# Altium schematic sheet MCU.SchDoc (part 3 of 3)
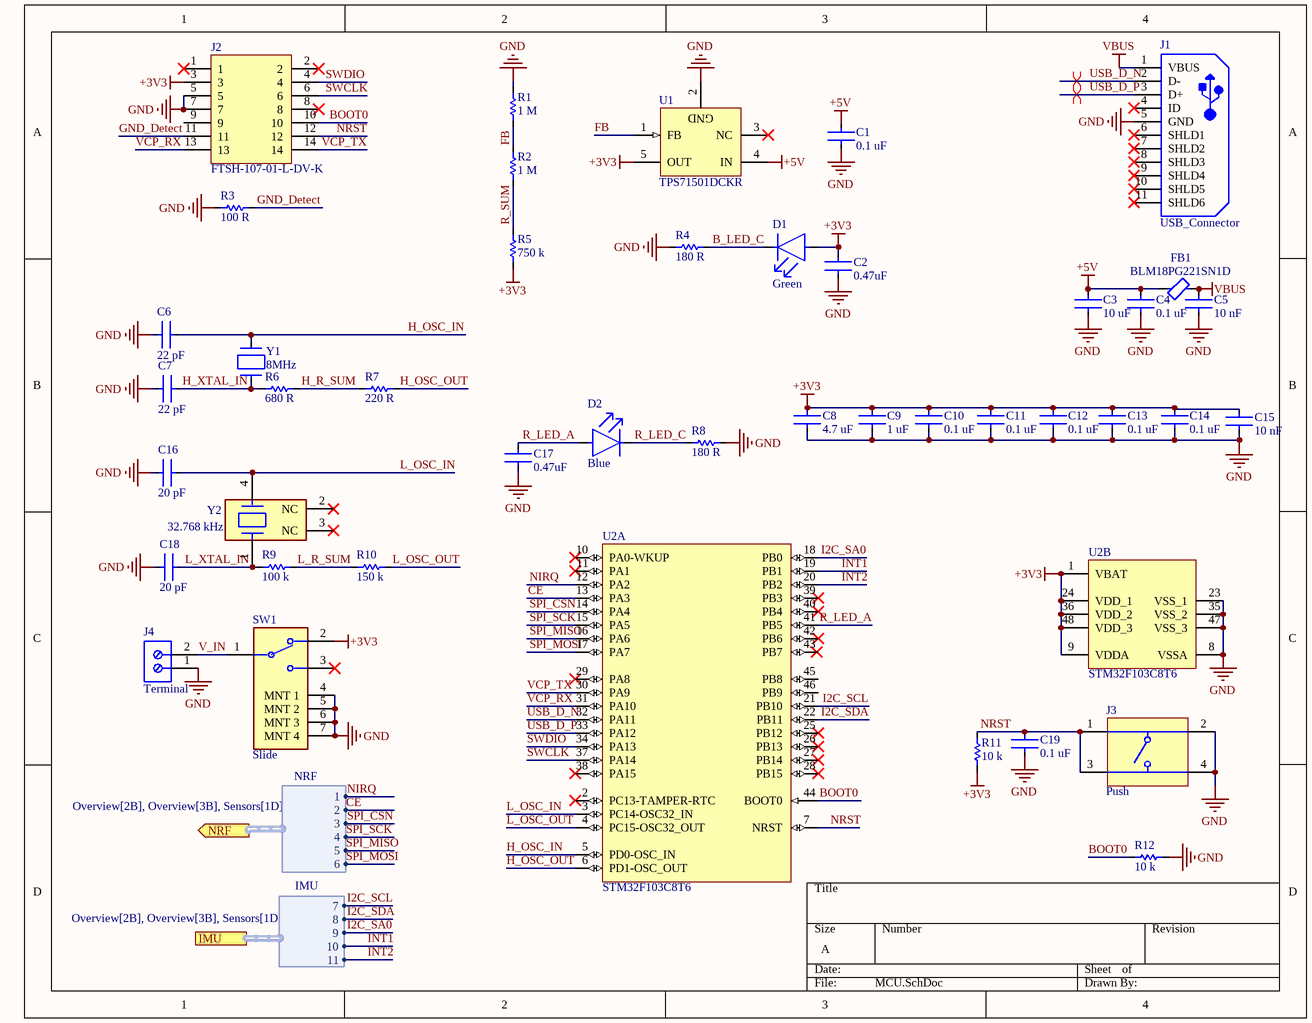
[diagram p2: MCU.SchDoc]

## Library data of the parts (continued)
R9 = 100k_0603_Resistor: Fixed Resistor, Metal Glaze/thick Film, 0.1W, 100000ohm, 75V, 1% +/-Tol, 100ppm/Cel, Surface Mount, 0603, AC0603FR-07100KL; Manufacturer: Yageo; Power: 100mW; Rated Temperature: 70°C; Value: 100kR; Temperature Coefficient: 100ppm/°C; Additional Feature: LASER TRIMMABLE; Package Height: 0.45mm; Package Length: 1.6mm; Package Width: 0.8mm; Reference Standard: AEC-Q200; Supplier: Digikey; Supplier Part Number: 311-100KLDCT-ND; Manufacturer Part Number: AC0603FR-07100KL; RoHS: Yes; Category: Chip SMD Resistors; Stock: 796898; Pricing: 1=0.1, 10=0.021, 50=0.013, 100=0.0108, 500=0.00734, 1000=0.00633 (USD); Mounting Technology: Surface Mount; Pins: 2; Case/Package: 0603; Terminal Finish: Nickel; Package Shape: Rectangular; Min Operating Temperature: -55°C; Max Operating Temperature: 155°C; Tolerance: 1%; JESD-609 Code: e3; Resistor Type: FIXED RESISTOR; Construction: Chip; Package Style: SMTMeter; Packaging: Tape and Reel; Technology: METAL GLAZE/THICK FILM; Termination: Wraparound; Working Voltage: 75V; Reach SVHC Compliant: Yes; RoHS Compliant: Yes; ComponentLink1URL: https://datasheet.ciiva.com:443/pdfs/VipMasterIC/IC/YAGO/YAGO-S-A0003597364/YAGO-S-A0003597364-1.pdf?src-supplier=IHS+Markit; ComponentLink1Description: https://datasheet.ciiva.com:443/pdfs/VipMasterIC/IC/YAGO/YAGO-S-A0003597364/YAGO-S-A0003597364-1.pdf?src-supplier=IHS+Markit; ComponentLink2URL: https://datasheet.ciiva.com/26862/getdatasheetpartid-715379-26862460.pdf?src-supplier=Verical; ComponentLink2Description: https://datasheet.ciiva.com/26862/getdatasheetpartid-715379-26862460.pdf?src-supplier=Verical; ComponentLink3URL: https://datasheet.ciiva.com/5562/pyu-ac-51-rohs-l-2-5562536.pdf?src-supplier=Mouser; ComponentLink3Description: https://datasheet.ciiva.com/5562/pyu-ac-51-rohs-l-2-5562536.pdf?src-supplier=Mouser; Supplier 1: Digikey; Supplier Part Number 1: 311-100KLDCT-ND
R10 = 150k_0603_Resistor: Fixed Resistor, Metal Glaze/thick Film, 0.1W, 150000ohm, 75V, 1% +/-Tol, 100ppm/Cel, Surface Mount, 0603, RC0603FR-07150KL; Manufacturer: Yageo; Power: 100mW; Rated Temperature: 70°C; Value: 150kR; Temperature Coefficient: 100ppm/°C; Additional Feature: LASER TRIMMABLE; Package Height: 0.45mm; Package Length: 1.6mm; Package Width: 0.8mm; Supplier: Digikey; Supplier Part Number: 311-150KHRCT-ND; Manufacturer Part Number: RC0603FR-07150KL; RoHS: Yes; Category: Chip SMD Resistors; Stock: 109674; Pricing: 1=0.1, 10=0.019, 50=0.0112, 100=0.0093, 500=0.00622, 1000=0.00532 (USD); Mounting Technology: Surface Mount; Pins: 2; Case/Package: 0603; Terminal Finish: Nickel; Package Shape: Rectangular; Min Operating Temperature: -55°C; Max Operating Temperature: 155°C; Tolerance: 1%; JESD-609 Code: e3; Resistor Type: FIXED RESISTOR; Packaging: Tape and Reel; Technology: METAL GLAZE/THICK FILM; Termination: Wraparound; Working Voltage: 75V; Construction: Chip; Package Style: SMTMeter; Reach SVHC Compliant: Yes; RoHS Compliant: Yes; ComponentLink1URL: https://datasheet.ciiva.com:443/pdfs/VipMasterIC/IC/YAGO/YAGO-S-A0008145938/YAGO-S-A0008145938-1.pdf?src-supplier=IHS+Markit; ComponentLink1Description: https://datasheet.ciiva.com:443/pdfs/VipMasterIC/IC/YAGO/YAGO-S-A0008145938/YAGO-S-A0008145938-1.pdf?src-supplier=IHS+Markit; ComponentLink2URL: https://datasheet.ciiva.com/46412/443971-46412843.pdf?src-supplier=Element14; ComponentLink2Description: https://datasheet.ciiva.com/46412/443971-46412843.pdf?src-supplier=Element14; ComponentLink3URL: https://datasheet.ciiva.com/46440/1868787-46440892.pdf?src-supplier=Element14; ComponentLink3Description: https://datasheet.ciiva.com/46440/1868787-46440892.pdf?src-supplier=Element14; ComponentLink4URL: https://datasheet.ciiva.com/7746/443971-7746254.pdf?src-supplier=Element14; ComponentLink4Description: https://datasheet.ciiva.com/7746/443971-7746254.pdf?src-supplier=Element14; ComponentLink5URL: https://datasheet.ciiva.com/7746/443971-7746255.pdf?src-supplier=Element14; ComponentLink5Description: https://datasheet.ciiva.com/7746/443971-7746255.pdf?src-supplier=Element14; ComponentLink6URL: https://datasheet.ciiva.com/2454/pyu-r-int-thick-7-2454078.pdf?src-supplier=Digikey; ComponentLink6Description: https://datasheet.ciiva.com/2454/pyu-r-int-thick-7-2454078.pdf?src-supplier=Digikey; ComponentLink7URL: https://datasheet.ciiva.com/2454/pyu-r-int-thick-7-2454079.pdf?src-supplier=Digikey; ComponentLink7Description: https://datasheet.ciiva.com/2454/pyu-r-int-thick-7-2454079.pdf?src-supplier=Digikey; ComponentLink8URL: https://datasheet.ciiva.com/2454/pyu-r-int-thick-7-2454080.pdf?src-supplier=Digikey; ComponentLink8Description: https://datasheet.ciiva.com/2454/pyu-r-int-thick-7-2454080.pdf?src-supplier=Digikey; ComponentLink9URL: https://datasheet.ciiva.com/15189/getdatasheetpartid-326478-15189611.pdf?src-supplier=Verical; ComponentLink9Description: https://datasheet.ciiva.com/15189/getdatasheetpartid-326478-15189611.pdf?src-supplier=Verical; Supplier 1: Digikey; Supplier Part Number 1: 311-150KHRCT-ND
R11 R12 = 10k_0603_Resistor: Fixed Resistor, Thin Film, 0.1W, 10000ohm, 75V, 0.1% +/-Tol, 25ppm/Cel, Surface Mount, 0603, RT0603BRD1010KL; Manufacturer: Yageo; Manufacturer Series: RT; Power: 100mW; Rated Temperature: 70°C; Value: 10kR; Temperature Coefficient: 25ppm/°C; Package Height: 0.45mm; Package Length: 1.6mm; Package Width: 0.8mm; Supplier: Digikey; Supplier Part Number: YAG5992CT-ND; Manufacturer Part Number: RT0603BRD1010KL; RoHS: Yes; Category: Chip SMD Resistors; Stock: 71276; Pricing: 1=0.14, 10=0.104, 50=0.0822, 100=0.0737, 500=0.05612, 1000=0.04959, 5000=0.03675 (USD); Mounting Technology: Surface Mount; Pins: 2; Package Shape: Rectangular; Case/Package: 0603; Terminal Finish: Nickel; Min Operating Temperature: -55°C; Max Operating Temperature: 155°C; Tolerance: 0.1%; JESD-609 Code: e3; Resistor Type: FIXED RESISTOR; Construction: Chip; Package Style: SMTMeter; Packaging: Tape and Reel; Series: RT; Technology: THIN FILM; Termination: Wraparound; Working Voltage: 75V; Reach SVHC Compliant: Yes; RoHS Compliant: Yes; ComponentLink1URL: https://datasheet.ciiva.com:443/pdfs/VipMasterIC/IC/YAGO/YAGO-S-A0008510989/YAGO-S-A0008510989-1.pdf?src-supplier=IHS+Markit; ComponentLink1Description: https://datasheet.ciiva.com:443/pdfs/VipMasterIC/IC/YAGO/YAGO-S-A0008510989/YAGO-S-A0008510989-1.pdf?src-supplier=IHS+Markit; ComponentLink2URL: https://www.yageo.com/upload/media/product/productsearch/datasheet/rchip/PYu-RT_1-to-0.01_RoHS_L_12.pdf?src-supplier=Digikey; ComponentLink2Description: https://www.yageo.com/upload/media/product/productsearch/datasheet/rchip/PYu-RT_1-to-0.01_RoHS_L_12.pdf?src-supplier=Digikey; ComponentLink3URL: https://datasheet.octopart.com/RT0603BRD1010KL-Yageo-datasheet-169971040.pdf?src-supplier=Future+Electronics; ComponentLink3Description: https://datasheet.octopart.com/RT0603BRD1010KL-Yageo-datasheet-169971040.pdf?src-supplier=Future+Electronics; Supplier 1: Digikey; Supplier Part Number 1: YAG5992CT-ND
SW1 = Slide_Switch: Slide Switch, SPDT, Latched, 0.3A, 6VDC, Solder Terminal, Surface Mount-right Angle, PCM12SMTR; Manufacturer: ITT C&K; Manufacturer Series: PCM; Contact Current(DC)-Max: 300mA; Contact DC Max Rating R Load: .3A@6VDC; Contact Voltage(DC)-Max: 6V; Additional Feature: Low Profile; Body Breadth: 2.6inch; Body Height: 1.4mm; Body Length or Diameter: 6.7mm; Supplier: Digikey; Supplier Part Number: 401-2016-1-ND; Manufacturer Part Number: PCM12SMTR; RoHS: Yes; Category: Slide Switches; Stock: 2420; Pricing: 1=1.06, 10=1.02, 25=0.9588, 100=0.8283, 250=0.75488, 500=0.70182, 1000=0.65286 (USD); Mounting Technology: Surface Mount; Terminal Finish: Silver; Min Operating Temperature: -10°C; Max Operating Temperature: 85°C; JESD-609 Code: e4; Packaging: Tape and Reel; Switch Action: LATCHED; Switch Function: SPDT; Switch Type: Slide Switch; Termination: Solder; RoHS Compliant: Yes; ComponentLink1URL: https://datasheet.ciiva.com:443/pdfs/VipMasterIC/IC/ITTC/ITTCS01579/ITTCS01579-1.pdf?src-supplier=IHS+Markit; ComponentLink1Description: https://datasheet.ciiva.com:443/pdfs/VipMasterIC/IC/ITTC/ITTCS01579/ITTCS01579-1.pdf?src-supplier=IHS+Markit; ComponentLink2URL: https://datasheet.ciiva.com/5279/pcm-5oct11-24112-5279535.pdf?src-supplier=Mouser; ComponentLink2Description: https://datasheet.ciiva.com/5279/pcm-5oct11-24112-5279535.pdf?src-supplier=Mouser; ComponentLink3URL: https://datasheet.ciiva.com/16174/pcm-30mar11-16174552.pdf?src-supplier=Onlinecomponents.com; ComponentLink3Description: https://datasheet.ciiva.com/16174/pcm-30mar11-16174552.pdf?src-supplier=Onlinecomponents.com; ComponentLink4URL: https://datasheet.ciiva.com/1532/1685524-1532411.pdf?src-supplier=Element14; ComponentLink4Description: https://datasheet.ciiva.com/1532/1685524-1532411.pdf?src-supplier=Element14; ComponentLink5URL: https://datasheet.ciiva.com/16475/pcm12smtr-16475766.pdf?src-supplier=Future+Electronics; ComponentLink5Description: https://datasheet.ciiva.com/16475/pcm12smtr-16475766.pdf?src-supplier=Future+Electronics; ComponentLink6URL: https://datasheet.ciiva.com/2889/pcm-13nov13-2889154.pdf?src-supplier=Digikey; ComponentLink6Description: https://datasheet.ciiva.com/2889/pcm-13nov13-2889154.pdf?src-supplier=Digikey; ComponentLink7URL: https://datasheet.ciiva.com/2889/pcm-13nov13-2889155.pdf?src-supplier=Digikey; ComponentLink7Description: https://datasheet.ciiva.com/2889/pcm-13nov13-2889155.pdf?src-supplier=Digikey; ComponentLink8URL: https://datasheet.ciiva.com/2889/pcm-13nov13-2889156.pdf?src-supplier=Digikey; ComponentLink8Description: https://datasheet.ciiva.com/2889/pcm-13nov13-2889156.pdf?src-supplier=Digikey
U1 = 5V_3V3_LDO: Adjustable Positive LDO Regulator, 1.2V Min, 15V Max, 0.75V Dropout, PMOS, PDSO5, TPS71501DCKR Texas Instruments; Manufacturer Part Number: TPS71533DCKR; Package Body Material: Plastic; Adjustability: FIXED; Dropout Voltage1-Max: 750mV; Dropout Voltage1-Nom: 415mV; Input Voltage Absolute-Max: 24V; Min Input Voltage: 4.05V; Channels: 1; Output Current1-Max: 50mA; Output Voltage1-Max: 3.432V; Output Voltage1-Min: 3.168V; Output Voltage1-Nom: 3.3V; Regulator Type: FIXED POSITIVE SINGLE OUTPUT LDO REGULATOR; Voltage Tolerance-Max: 4%; Package Equivalence Code: TSSOP5/6,.08; Line Regulation-Max: 0.06%; Qualification Status: Not Qualified; Line Regulation-Max (%/V): 0.23; Supplier: Digikey; Supplier Part Number: 296-12008-1-ND; Manufacturer: Texas Instruments; RoHS: Yes; Category: Voltage Regulators - Linear; Stock: 232813; Pricing: 1=0.88, 10=0.773, 25=0.7264, 100=0.5928, 250=0.55064, 500=0.46864, 1000=0.37491 (USD); Case/Package: TSSOP; Pins: 5; Package Shape: Rectangular; Terminal Finish: Nickel; JESD-609 Code: e4; Max Supply Voltage: 24V; Number of Outputs: 1; Operating Temperature, TJ-Max: 125°C; Operating Temperature, TJ-Min: -40°C; Package Style: SMALL OUTLINE, THIN PROFILE, SHRINK PITCHMeter; Surface Mount: Yes; Technology: PMOS; Terminal Form: Gull Wing; Terminal Position: DUAL; JESD-30 Code: R-PDSO-G5; Moisture Sensitivity Level: 1; Packaging: Tape and Reel; Peak Reflow Temperature (Cel): 260°C; Length: 2mm; Width: 1.25mm; Terminal Pitch: 0.65mm; Height - Seated (Max): 1.1mm; Reach SVHC Compliant: Yes; RoHS Compliant: Yes; ComponentLink1URL: https://www.ti.com:443/lit/ds/symlink/tps715.pdf?src-supplier=IHS+Markit; ComponentLink1Description: https://www.ti.com:443/lit/ds/symlink/tps715.pdf?src-supplier=IHS+Markit; ComponentLink2URL: https://datasheet.ciiva.com/22700/1835023-22700176.pdf?src-supplier=Element14; ComponentLink2Description: https://datasheet.ciiva.com/22700/1835023-22700176.pdf?src-supplier=Element14; ComponentLink3URL: https://datasheet.ciiva.com/7992/1854688-7992972.pdf?src-supplier=Element14; ComponentLink3Description: https://datasheet.ciiva.com/7992/1854688-7992972.pdf?src-supplier=Element14; ComponentLink4URL: https://datasheet.ciiva.com/34301/1116531-34301990.pdf?src-supplier=Jameco; ComponentLink4Description: https://datasheet.ciiva.com/34301/1116531-34301990.pdf?src-supplier=Jameco; Supplier 1: Digikey; Supplier Part Number 1: 296-12957-1-ND
U2 = STM32F103C8T6: RISC Microcontroller, 32-Bit, FLASH, STM32 CPU, 72MHz, CMOS, PQFP48, STM32F103C8T6; Manufacturer: STMicroelectronics; Manufacturer Part Number: STM32C011F4U6TR; Package Body Material: Plastic; Clock Frequency: 16MHz; Number of I/O Lines: 37; Package Equivalence Code: QFP48,.35SQ,20; Power Supplies: 2.5/3.3V; Speed: 72RPM; Max Supply Current: 50mA; Max Supply Voltage: 3.6V; Min Supply Voltage: 2V; Nominal Supply Voltage: 3.3V; Time @ Peak Reflow Temperature-Max (s): 30s; Qualification Status: Not Qualified; Supplier: Digikey; Supplier Part Number: 497-STM32C011F4U6TRCT-ND; RoHS: No; Stock: 16983; Pricing: 1=1.19, 10=1.061, 25=1.0068, 100=0.827, 250=0.77304, 500=0.68316, 1000=0.53934 (USD); ComponentLink1URL: https://datasheet.octopart.com/STM32C011F4U6TR-STMicroelectronics-datasheet-175903386.pdf?src-supplier=Future+Electronics; ComponentLink1Description: https://datasheet.octopart.com/STM32C011F4U6TR-STMicroelectronics-datasheet-175903386.pdf?src-supplier=Future+Electronics; Category: Microcontrollers; Reach SVHC Compliant: Yes; RoHS Compliant: Yes; ComponentLink2URL: https://datasheet.ciiva.com:443/pdfs/VipMasterIC/IC/SGST/SGST-S-A0005002368/SGST-S-A0005002368-1.pdf?src-supplier=IHS+Markit; ComponentLink2Description: https://datasheet.ciiva.com:443/pdfs/VipMasterIC/IC/SGST/SGST-S-A0005002368/SGST-S-A0005002368-1.pdf?src-supplier=IHS+Markit; ComponentLink3URL: http://www.farnell.com/datasheets/2283391.pdf?src-supplier=Farnell; ComponentLink3Description: http://www.farnell.com/datasheets/2283391.pdf?src-supplier=Farnell; ComponentLink4URL: http://www.st.com/content/ccc/resource/technical/document/datasheet/24/01/9f/59/f0/83/47/fc/DM00257205.pdf/files/DM00257205.pdf/jcr:content/translations/en.DM00257205.pdf?src-supplier=Digikey; ComponentLink4Description: http://www.st.com/content/ccc/resource/technical/document/datasheet/24/01/9f/59/f0/83/47/fc/DM00257205.pdf/files/DM00257205.pdf/jcr:content/translations/en.DM00257205.pdf?src-supplier=Digikey; ComponentLink5URL: http://www.farnell.com/datasheets/2283391.pdf?src-supplier=Newark; ComponentLink5Description: http://www.farnell.com/datasheets/2283391.pdf?src-supplier=Newark; ComponentLink6URL: https://datasheet.octopart.com/STM32L432KBU6-STMicroelectronics-datasheet-62336852.pdf?src-supplier=SHENGYU+ELECTRONICS; ComponentLink6Description: https://datasheet.octopart.com/STM32L432KBU6-STMicroelectronics-datasheet-62336852.pdf?src-supplier=SHENGYU+ELECTRONICS; Case/Package: LFQFP; Pins: 48; Package Shape: Square; Terminal Finish: Nickel; Min Operating Temperature: -40°C; Max Operating Temperature: 105°C; JESD-609 Code: e4; JESD-30 Code: S-PQFP-G48; Moisture Sensitivity Level: 2; Package Style: FLATPACK, LOW PROFILE, FINE PITCHMeter; Surface Mount: Yes; Technology: CMOS; Terminal Form: Gull Wing; Terminal Position: QUAD; Peak Reflow Temperature (Cel): 260°C; Length: 7mm; Width: 7mm; Height - Seated (Max): 1.6mm; Terminal Pitch: 0.5mm; Temperature Grade: INDUSTRIAL; ComponentLink7URL: https://datasheet.ciiva.com:443/pdfs/VipMasterIC/IC/SGST/SGST-S-A0001117293/SGST-S-A0001117293-1.pdf?src-supplier=IHS+Markit; ComponentLink7Description: https://datasheet.ciiva.com:443/pdfs/VipMasterIC/IC/SGST/SGST-S-A0001117293/SGST-S-A0001117293-1.pdf?src-supplier=IHS+Markit; ComponentLink8URL: https://datasheet.ciiva.com/15122/getdatasheetpartid-69880-15122076.pdf?src-supplier=Verical; ComponentLink8Description: https://datasheet.ciiva.com/15122/getdatasheetpartid-69880-15122076.pdf?src-supplier=Verical; ComponentLink9URL: https://datasheet.ciiva.com/14100/pustm-arm-microcont-stm32f103-en-14100508.pdf?src-supplier=Distrelec; ComponentLink9Description: https://datasheet.ciiva.com/14100/pustm-arm-microcont-stm32f103-en-14100508.pdf?src-supplier=Distrelec; ComponentLink10URL: https://datasheet.ciiva.com/8054/1730126-8054942.pdf?src-supplier=Element14; ComponentLink10Description: https://datasheet.ciiva.com/8054/1730126-8054942.pdf?src-supplier=Element14; ComponentLink11URL: https://datasheet.ciiva.com/16210/cd00161566-16210248.pdf?src-supplier=Future+Electronics; ComponentLink11Description: https://datasheet.ciiva.com/16210/cd00161566-16210248.pdf?src-supplier=Future+Electronics; ComponentLink12URL: https://datasheet.ciiva.com/48687/001075658-da-01-en-mcu-64kb-mem-stm32f103c8t6-lqfp-48-stm-48687589.pdf?src-supplier=Conrad; ComponentLink12Description: https://datasheet.ciiva.com/48687/001075658-da-01-en-mcu-64kb-mem-stm32f103c8t6-lqfp-48-stm-48687589.pdf?src-supplier=Conrad; Supplier 1: Future Electronics; Supplier Part Number 1: 6124222
Y1 = 8MHz_Oscillator: Crystal 8MHz ±20ppm (Tol) ±30ppm (Stability) 18pF FUND 100Ohm 2-Pin Mini-CSMD T/R, ABM7-8.000MHZ-D2Y-T; Manufacturer: Abracon; Supplier: Digikey; Supplier Part Number: 535-9831-1-ND; Manufacturer Part Number: ABM7-8.000MHZ-D2Y-T; RoHS: Yes; Category: Crystals; Stock: 52812; Pricing: 1=0.69, 10=0.577, 50=0.519, 100=0.4613, 500=0.4382 (USD); ComponentLink1URL: https://datasheet.ciiva.com/1357/1718755-1357277.pdf?src-supplier=Element14; ComponentLink1Description: https://datasheet.ciiva.com/1357/1718755-1357277.pdf?src-supplier=Element14; ComponentLink2URL: https://datasheet.ciiva.com/15116/getdatasheetpartid-722403-15116844.pdf?src-supplier=Verical; ComponentLink2Description: https://datasheet.ciiva.com/15116/getdatasheetpartid-722403-15116844.pdf?src-supplier=Verical; ComponentLink3URL: https://datasheet.ciiva.com/4944/abm7-19096-4944987.pdf?src-supplier=Mouser; ComponentLink3Description: https://datasheet.ciiva.com/4944/abm7-19096-4944987.pdf?src-supplier=Mouser; ComponentLink4URL: https://datasheet.ciiva.com/29998/abm7-29998171.pdf?src-supplier=Avnet; ComponentLink4Description: https://datasheet.ciiva.com/29998/abm7-29998171.pdf?src-supplier=Avnet; ComponentLink5URL: https://datasheet.ciiva.com/16416/abm7-16416924.pdf?src-supplier=Future+Electronics; ComponentLink5Description: https://datasheet.ciiva.com/16416/abm7-16416924.pdf?src-supplier=Future+Electronics; Supplier 1: Digikey; Supplier Part Number 1: 535-9831-1-ND
Y2 = 32_768kHz_Oscillator: Parallel - Fundamental Quartz Crystal, 0.032768MHz Nom, ABS25-32.768KHZ-T; Manufacturer: Abracon; Aging: 5 PPM/FIRST YEAR; Drive Level: 1uW; Frequency Tolerance: 20ppm; Load Capacitance: 12.5pF; Operating Frequency-Nom: 32.768; ESR: 50kR; Additional Feature: TAPE AND REEL; Supplier: Digikey; Supplier Part Number: 535-9166-1-ND; Manufacturer Part Number: ABS25-32.768KHZ-T; RoHS: Yes; Category: Crystals; Stock: 334703; Pricing: 1=0.5, 10=0.418, 50=0.3764, 100=0.3346, 500=0.3179, 1000=0.26771 (USD); Mounting Technology: Surface Mount; Terminal Finish: Tin; Min Operating Temperature: -40°C; Max Operating Temperature: 85°C; Crystal/Resonator Type: PARALLEL - FUNDAMENTAL; JESD-609 Code: e2; RoHS Compliant: Yes; Reach SVHC Compliant: No; ComponentLink1URL: https://datasheet.ciiva.com:443/pdfs/VipMasterIC/IC/ABRC/ABRC-S-A0006623177/ABRC-S-A0006623177-1.pdf?src-supplier=IHS+Markit; ComponentLink1Description: https://datasheet.ciiva.com:443/pdfs/VipMasterIC/IC/ABRC/ABRC-S-A0006623177/ABRC-S-A0006623177-1.pdf?src-supplier=IHS+Markit; Supplier 1: Digikey; Supplier Part Number 1: 535-9166-1-ND